# EAGLE schematic 8x8LED Matrix_v1.0 (EAGLE 7.2.0)
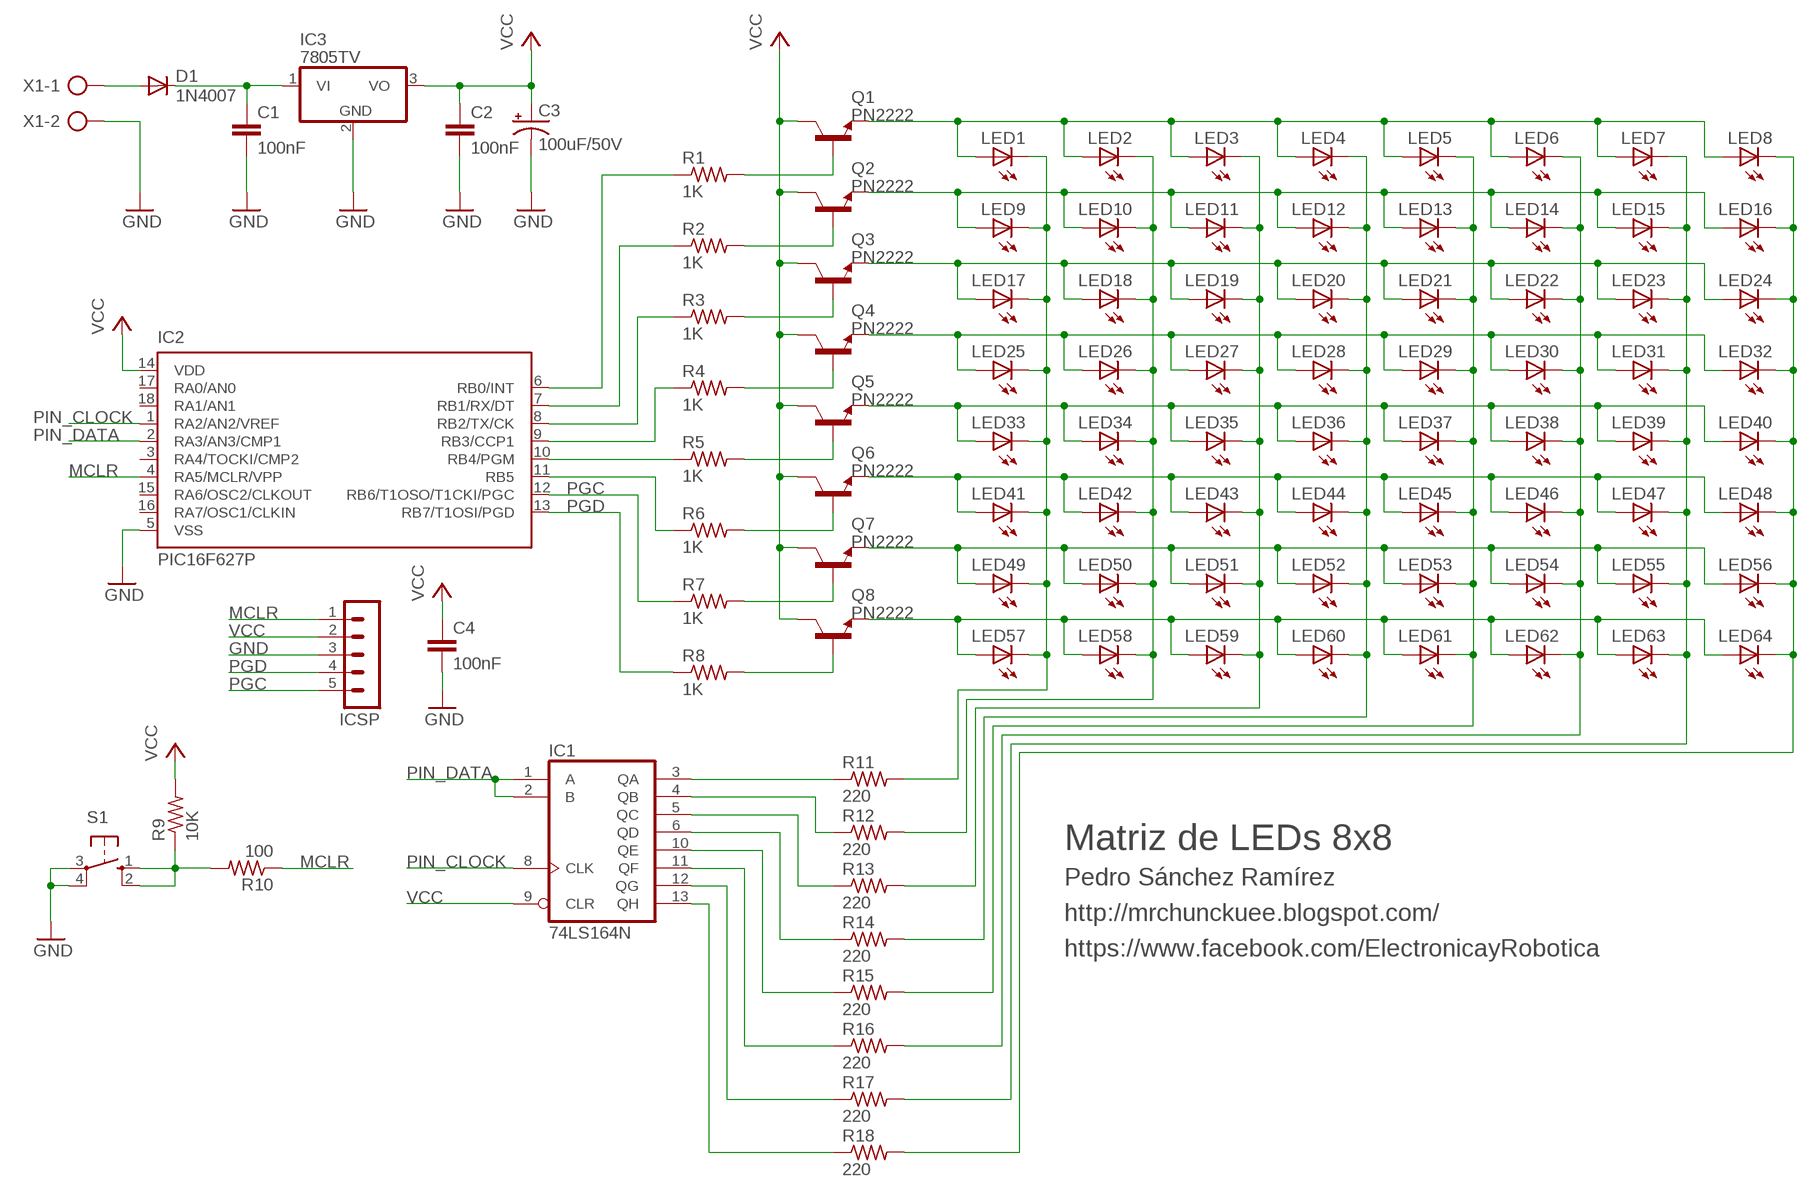
[diagram p0: schematic, sheet 1]

## Parts
C1  100nF  C-EU050-024X044  [C050-024X044]
C2  100nF  C-EU050-024X044  [C050-024X044]
C3  100uF/50V  CPOL-USE5-10.5  [E5-10,5]
C4  100nF  C-EU050-024X044  [C050-024X044]
D1  1N4007  1N4004  [DO41-10]
IC1  74LS164N  [DIL14]
IC2  PIC16F627P  [DIL18]
IC3  7805TV  [TO220V]
ICSP  MA05-1  [MA05-1]
LED1  LED5MM  [LED5MM]
LED2  LED5MM  [LED5MM]
LED3  LED5MM  [LED5MM]
LED4  LED5MM  [LED5MM]
LED5  LED5MM  [LED5MM]
LED6  LED5MM  [LED5MM]
LED7  LED5MM  [LED5MM]
LED8  LED5MM  [LED5MM]
LED9  LED5MM  [LED5MM]
LED10  LED5MM  [LED5MM]
LED11  LED5MM  [LED5MM]
LED12  LED5MM  [LED5MM]
LED13  LED5MM  [LED5MM]
LED14  LED5MM  [LED5MM]
LED15  LED5MM  [LED5MM]
LED16  LED5MM  [LED5MM]
LED17  LED5MM  [LED5MM]
LED18  LED5MM  [LED5MM]
LED19  LED5MM  [LED5MM]
LED20  LED5MM  [LED5MM]
LED21  LED5MM  [LED5MM]
LED22  LED5MM  [LED5MM]
LED23  LED5MM  [LED5MM]
LED24  LED5MM  [LED5MM]
LED25  LED5MM  [LED5MM]
LED26  LED5MM  [LED5MM]
LED27  LED5MM  [LED5MM]
LED28  LED5MM  [LED5MM]
LED29  LED5MM  [LED5MM]
LED30  LED5MM  [LED5MM]
LED31  LED5MM  [LED5MM]
LED32  LED5MM  [LED5MM]
LED33  LED5MM  [LED5MM]
LED34  LED5MM  [LED5MM]
LED35  LED5MM  [LED5MM]
LED36  LED5MM  [LED5MM]
LED37  LED5MM  [LED5MM]
LED38  LED5MM  [LED5MM]
LED39  LED5MM  [LED5MM]
LED40  LED5MM  [LED5MM]
LED41  LED5MM  [LED5MM]
LED42  LED5MM  [LED5MM]
LED43  LED5MM  [LED5MM]
LED44  LED5MM  [LED5MM]
LED45  LED5MM  [LED5MM]
LED46  LED5MM  [LED5MM]
LED47  LED5MM  [LED5MM]
LED48  LED5MM  [LED5MM]
LED49  LED5MM  [LED5MM]
LED50  LED5MM  [LED5MM]
LED51  LED5MM  [LED5MM]
LED52  LED5MM  [LED5MM]
LED53  LED5MM  [LED5MM]
LED54  LED5MM  [LED5MM]
LED55  LED5MM  [LED5MM]
LED56  LED5MM  [LED5MM]
LED57  LED5MM  [LED5MM]
LED58  LED5MM  [LED5MM]
LED59  LED5MM  [LED5MM]
LED60  LED5MM  [LED5MM]
LED61  LED5MM  [LED5MM]
LED62  LED5MM  [LED5MM]
LED63  LED5MM  [LED5MM]
LED64  LED5MM  [LED5MM]
Q1  PN2222  2N4124-NPN-TO92-EBC  [TO92-EBC]
Q2  PN2222  2N4124-NPN-TO92-EBC  [TO92-EBC]
Q3  PN2222  2N4124-NPN-TO92-EBC  [TO92-EBC]
Q4  PN2222  2N4124-NPN-TO92-EBC  [TO92-EBC]
Q5  PN2222  2N4124-NPN-TO92-EBC  [TO92-EBC]
Q6  PN2222  2N4124-NPN-TO92-EBC  [TO92-EBC]
Q7  PN2222  2N4124-NPN-TO92-EBC  [TO92-EBC]
Q8  PN2222  2N4124-NPN-TO92-EBC  [TO92-EBC]
R1  1K  R-US_0204/7  [0204/7]
R2  1K  R-US_0204/7  [0204/7]
R3  1K  R-US_0204/7  [0204/7]
R4  1K  R-US_0204/7  [0204/7]
R5  1K  R-US_0204/7  [0204/7]
R6  1K  R-US_0204/7  [0204/7]
R7  1K  R-US_0204/7  [0204/7]
R8  1K  R-US_0204/7  [0204/7]
R9  10K  R-US_0204/7  [0204/7]
R10  100  R-US_0204/7  [0204/7]
R11  220  R-US_0204/7  [0204/7]
R12  220  R-US_0204/7  [0204/7]
R13  220  R-US_0204/7  [0204/7]
R14  220  R-US_0204/7  [0204/7]
R15  220  R-US_0204/7  [0204/7]
R16  220  R-US_0204/7  [0204/7]
R17  220  R-US_0204/7  [0204/7]
R18  220  R-US_0204/7  [0204/7]
S1  10-XX  [B3F-10XX]
X1  AK500/2-H  [AK500/2-H]

## Nets
GND: C1.2 C2.2 C3.- C4.2 IC2.5(VSS) IC3.2(GND) ICSP.3 S1.3(P) S1.4(P1) X1.2
MCLR: IC2.4(RA5/MCLR/VPP) ICSP.1 R10.1
N$1: LED1.A LED2.A LED3.A LED4.A LED5.A LED6.A LED7.A LED8.A Q1.E
N$2: LED57.A LED58.A LED59.A LED60.A LED61.A LED62.A LED63.A LED64.A Q8.E
N$3: LED25.A LED26.A LED27.A LED28.A LED29.A LED30.A LED31.A LED32.A Q4.E
N$4: LED9.A LED10.A LED11.A LED12.A LED13.A LED14.A LED15.A LED16.A Q2.E
N$5: LED33.A LED34.A LED35.A LED36.A LED37.A LED38.A LED39.A LED40.A Q5.E
N$6: LED49.A LED50.A LED51.A LED52.A LED53.A LED54.A LED55.A LED56.A Q7.E
N$7: D1.A X1.1
N$8: LED17.A LED18.A LED19.A LED20.A LED21.A LED22.A LED23.A LED24.A Q3.E
N$9: LED41.A LED42.A LED43.A LED44.A LED45.A LED46.A LED47.A LED48.A Q6.E
N$17: Q1.B R1.2
N$18: Q8.B R8.2
N$19: Q7.B R7.2
N$20: Q6.B R6.2
N$21: Q5.B R5.2
N$22: Q4.B R4.2
N$23: Q2.B R2.2
N$24: Q3.B R3.2
N$25: IC2.8(RB2/TX/CK) R3.1
N$26: C1.1 D1.C IC3.1(VI)
N$28: IC2.9(RB3/CCP1) R4.1
N$29: IC2.10(RB4/PGM) R5.1
N$30: IC2.7(RB1/RX/DT) R2.1
N$31: IC2.6(RB0/INT) R1.1
N$32: IC2.11(RB5) R6.1
N$33: R9.1 R10.2 S1.1(S) S1.2(S1)
N$34: IC1.3(QA) R11.1
N$35: IC1.4(QB) R12.1
N$36: IC1.5(QC) R13.1
N$37: IC1.6(QD) R14.1
N$38: IC1.10(QE) R15.1
N$39: IC1.11(QF) R16.1
N$40: IC1.12(QG) R17.1
N$41: IC1.13(QH) R18.1
PGC: IC2.12(RB6/T1OSO/T1CKI/PGC) ICSP.5 R7.1
PGD: IC2.13(RB7/T1OSI/PGD) ICSP.4 R8.1
PIN_CLOCK: IC1.8(CLK) IC2.1(RA2/AN2/VREF)
PIN_DATA: IC1.1(A) IC1.2(B) IC2.2(RA3/AN3/CMP1)
QA: LED1.K(C) LED9.K(C) LED17.K(C) LED25.K(C) LED33.K(C) LED41.K(C) LED49.K(C) LED57.K(C) R11.2
QB: LED2.K(C) LED10.K(C) LED18.K(C) LED26.K(C) LED34.K(C) LED42.K(C) LED50.K(C) LED58.K(C) R12.2
QC: LED3.K(C) LED11.K(C) LED19.K(C) LED27.K(C) LED35.K(C) LED43.K(C) LED51.K(C) LED59.K(C) R13.2
QD: LED4.K(C) LED12.K(C) LED20.K(C) LED28.K(C) LED36.K(C) LED44.K(C) LED52.K(C) LED60.K(C) R14.2
QE: LED5.K(C) LED13.K(C) LED21.K(C) LED29.K(C) LED37.K(C) LED45.K(C) LED53.K(C) LED61.K(C) R15.2
QF: LED6.K(C) LED14.K(C) LED22.K(C) LED30.K(C) LED38.K(C) LED46.K(C) LED54.K(C) LED62.K(C) R16.2
QG: LED7.K(C) LED15.K(C) LED23.K(C) LED31.K(C) LED39.K(C) LED47.K(C) LED55.K(C) LED63.K(C) R17.2
QH: LED8.K(C) LED16.K(C) LED24.K(C) LED32.K(C) LED40.K(C) LED48.K(C) LED56.K(C) LED64.K(C) R18.2
VCC: C2.1 C3.+ C4.1 IC1.9(CLR) IC2.14(VDD) IC3.3(VO) ICSP.2 Q1.C Q2.C Q3.C Q4.C Q5.C Q6.C Q7.C Q8.C R9.2
Unconnected: IC2.3(RA4/TOCKI/CMP2) IC2.15(RA6/OSC2/CLKOUT) IC2.16(RA7/OSC1/CLKIN) IC2.17(RA0/AN0) IC2.18(RA1/AN1)

## Notes on the sheet
- Matriz de LEDs 8x8
- Pedro Sánchez Ramírez
- http://mrchunckuee.blogspot.com/
- https://www.facebook.com/ElectronicayRobotica

## Power pins joined to a net without a drawn wire
GND: IC1.7(GND)
VCC: IC1.14(VCC)

## Library data of the parts
C1 C2 C4 = rcl:C-EU: CAPACITOR, European symbol
C3 = rcl:CPOL-US: POLARIZED CAPACITOR, American symbol
D1 = diode:1N4004: DIODE general purpose rectifier, 1 A
IC1 = 74xx-us:74*164: 8-bit parallel out SHIFT REGISTER
IC2 = microchip:PIC16F62*: FLASH-Based 8-Bit CMOS Microcontroller Source: http://ww1.microchip.com/downloads/en/DeviceDoc/40300C.pdf; MF: MICROCHIP; MPN: PIC16F627-04/P; OC_FARNELL: 1084298; OC_NEWARK: 23C4960
IC3 = linear:78*: Positive VOLTAGE REGULATOR Source: http://cache.national.com/ds/LM/LM78L05.pdf http://www.fairchildsemi.com/ds/LM/LM7805.pdf
ICSP = con-lstb:MA05-1: PIN HEADER; OC_FARNELL: unknown; OC_NEWARK: unknown
LED1-LED64 = 1 MrChunckuee:LED: LED
Q1-Q8 = transistor-neu-to92:*-NPN-: NPN Transistror
R1-R18 = rcl:R-US_: RESISTOR, American symbol
S1 = switch-omron:10-XX: OMRON SWITCH; MPN: B3F-1000; OC_FARNELL: 176432; OC_NEWARK: 36M3542
X1 = con-ptr500:AK500/2-H: CONNECTOR Aug. 2004 / PTR Meßtechnik: Die Bezeichnung der Serie AK505 wurde geändert. Es handelt sich hierbei um AK500 in horizontaler Ausführung.; OC_FARNELL: unknown; OC_NEWARK: unknown